# EAGLE design G848M (EAGLE 6.6.0)
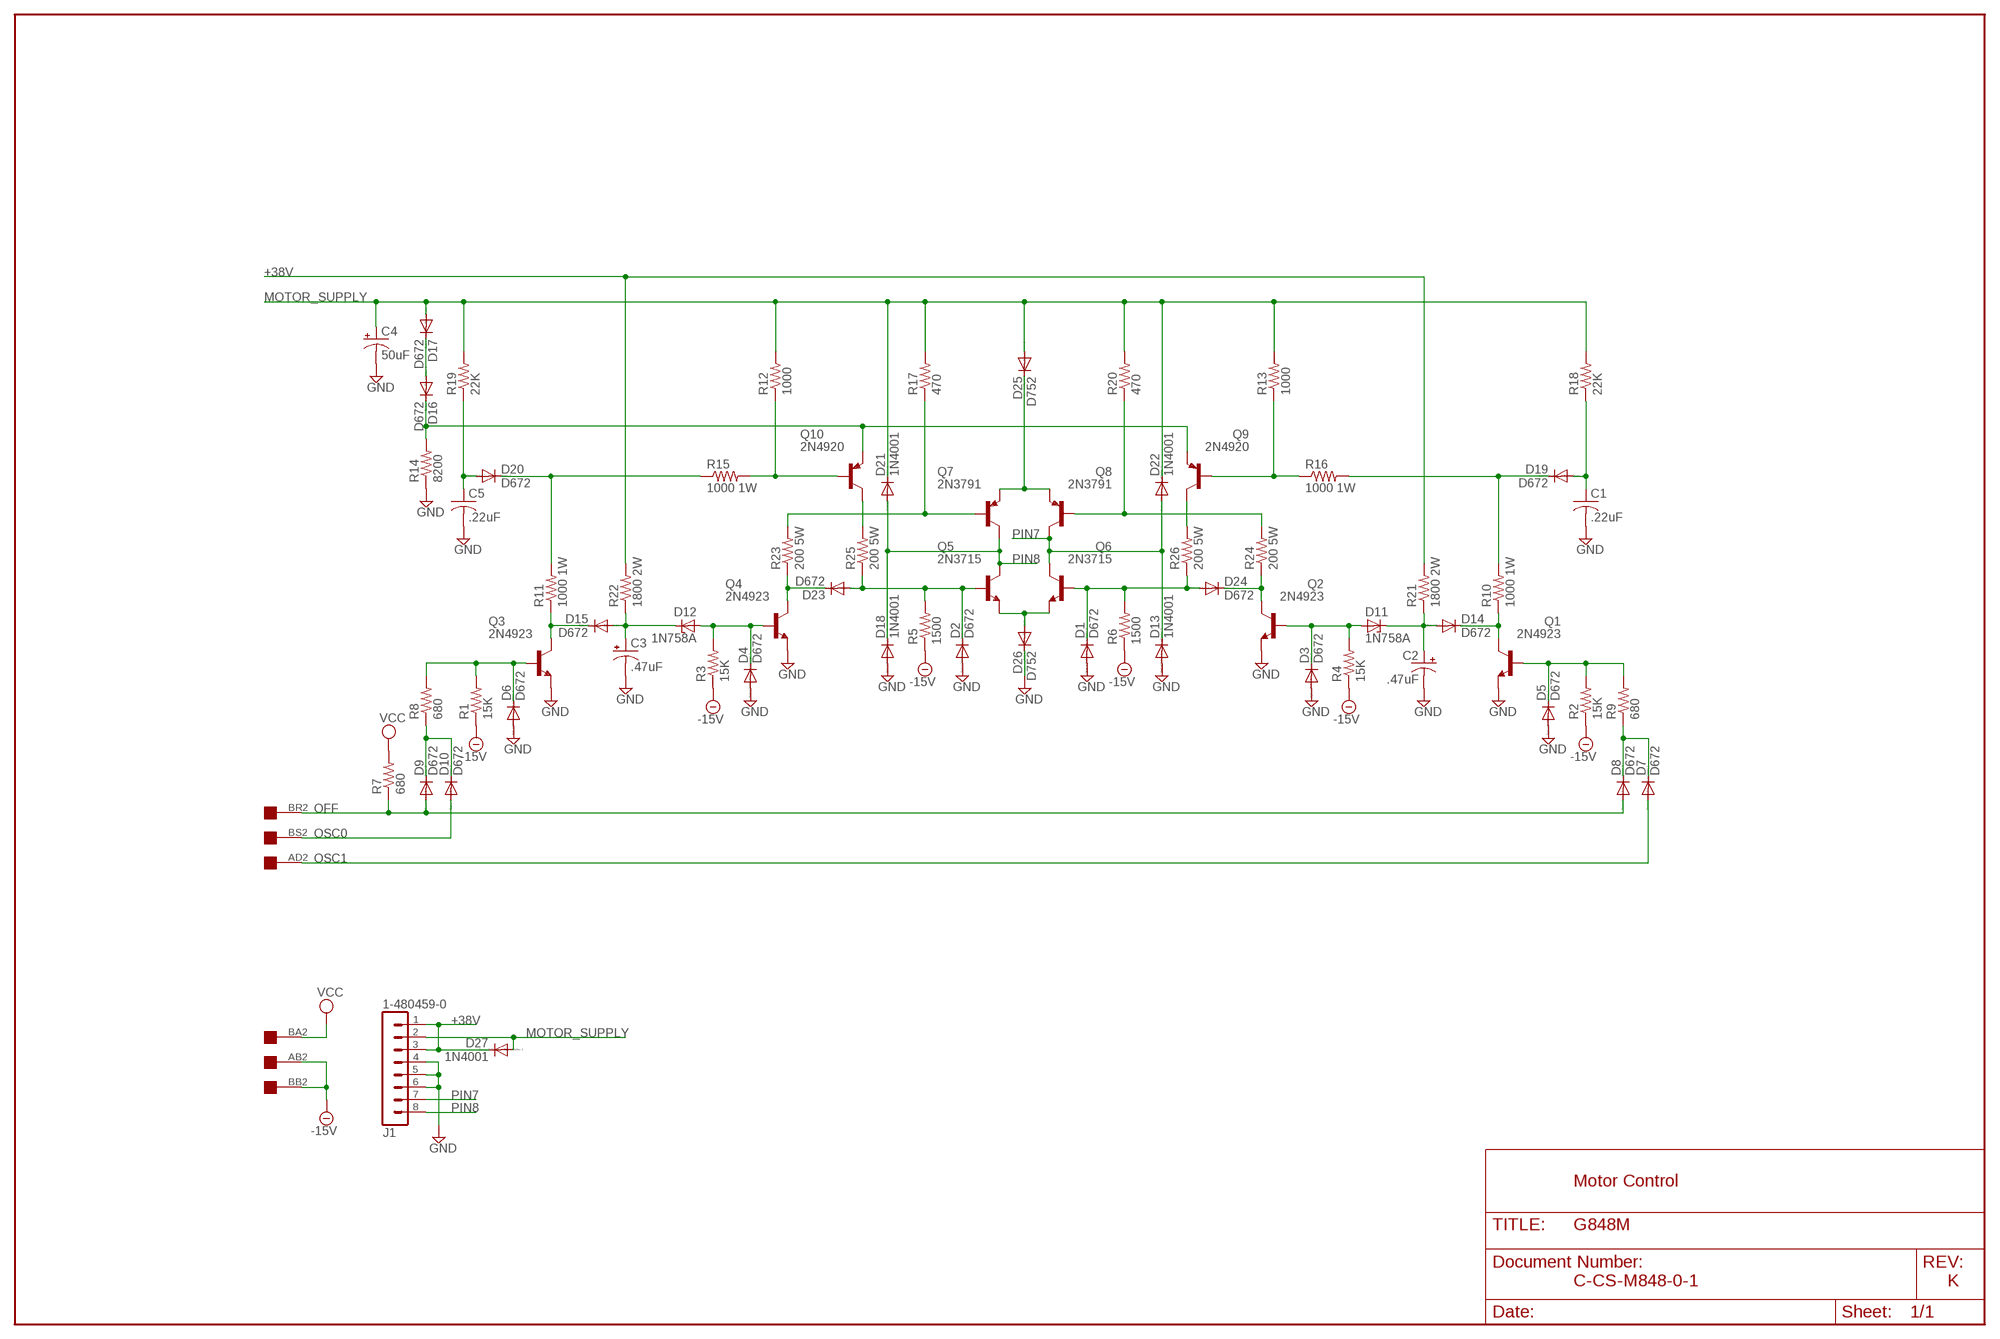
[diagram p0: schematic, sheet 1]

## Parts
C1  .22uF  C-US325-137X374  [C325-137X374]
C2  .47uF  CPOL-USE15-5AXIAL  [E15-5]
C3  .47uF  CPOL-USE15-5AXIAL  [E15-5]
C4  50uF  CPOL-USE30-10AXIAL  [E30-10]
C5  .22uF  C-US325-137X374  [C325-137X374]
D1  D672  DIODE-DO35-10  [DO35-10]
D2  D672  DIODE-DO35-10  [DO35-10]
D3  D672  DIODE-DO35-10  [DO35-10]
D4  D672  DIODE-DO35-10  [DO35-10]
D5  D672  DIODE-DO35-10  [DO35-10]
D6  D672  DIODE-DO35-10  [DO35-10]
D7  D672  DIODE-DO35-10  [DO35-10]
D8  D672  DIODE-DO35-10  [DO35-10]
D9  D672  DIODE-DO35-10  [DO35-10]
D10  D672  DIODE-DO35-10  [DO35-10]
D11  1N758A  ZENER-DIODEDO35Z10  [DO35Z10]
D12  1N758A  ZENER-DIODEDO35Z10  [DO35Z10]
D13  1N4001  1N4004  [DO41-10]
D14  D672  DIODE-DO35-10  [DO35-10]
D15  D672  DIODE-DO35-10  [DO35-10]
D16  D672  DIODE-DO35-10  [DO35-10]
D17  D672  DIODE-DO35-10  [DO35-10]
D18  1N4001  1N4004  [DO41-10]
D19  D672  DIODE-DO35-10  [DO35-10]
D20  D672  DIODE-DO35-10  [DO35-10]
D21  1N4001  1N4004  [DO41-10]
D22  1N4001  1N4004  [DO41-10]
D23  D672  DIODE-DO35-10  [DO35-10]
D24  D672  DIODE-DO35-10  [DO35-10]
D25  D752  DIODE-G4-12  [G4-12]
D26  D752  DIODE-G4-12  [G4-12]
D27  1N4001  1N4004  [DO41-10]
J1  1-480459-0  [1-480459-0]
Q1  2N4923  -NPN-TO225HH  [TO225AHH]
Q2  2N4923  -NPN-TO225HH  [TO225AHH]
Q3  2N4923  -NPN-TO225HH  [TO225AHH]
Q4  2N4923  -NPN-TO225HH  [TO225AHH]
Q5  2N3715  -NPN-TO3/  [TO3]
Q6  2N3715  -NPN-TO3/  [TO3]
Q7  2N3791  -PNP-TO3  [TO3]
Q8  2N3791  -PNP-TO3  [TO3]
Q9  2N4920  -PNP-TO225HH  [TO225AHH]
Q10  2N4920  -PNP-TO225HH  [TO225AHH]
R1  15K  R-US_0207/10  [0207/10]
R2  15K  R-US_0207/10  [0207/10]
R3  15K  R-US_0207/10  [0207/10]
R4  15K  R-US_0207/10  [0207/10]
R5  1500  R-US_0207/10  [0207/10]
R6  1500  R-US_0207/10  [0207/10]
R7  680  R-US_0207/10  [0207/10]
R8  680  R-US_0207/10  [0207/10]
R9  680  R-US_0207/10  [0207/10]
R10  1000 1W  R-US_0414/20  [0414/20]
R11  1000 1W  R-US_0414/20  [0414/20]
R12  1000  R-US_0207/10  [0207/10]
R13  1000  R-US_0207/10  [0207/10]
R14  8200  R-US_0207/10  [0207/10]
R15  1000 1W  R-US_0414/20  [0414/20]
R16  1000 1W  R-US_0414/20  [0414/20]
R17  470  R-US_0207/10  [0207/10]
R18  22K  R-US_0207/10  [0207/10]
R19  22K  R-US_0207/10  [0207/10]
R20  470  R-US_0207/10  [0207/10]
R21  1800 2W  R-US_0818/25  [0818/25]
R22  1800 2W  R-US_0818/25  [0818/25]
R23  200 5W  R-US_VTA54  [VTA54]
R24  200 5W  R-US_VTA54  [VTA54]
R25  200 5W  R-US_VTA54  [VTA54]
R26  200 5W  R-US_VTA54  [VTA54]
U$1  DOUBLE  [EDGE-CON4]

## Nets
+38V: D27.C J1.1 J1.3 R21.2 R22.2
-15V: R1.1 R2.1 R3.1 R4.1 R5.1 R6.1 U$1.AB2 U$1.BB2
GND: C1.2 C2.- C3.- C4.- C5.2 D1.A D2.A D3.A D4.A D5.A D6.A D13.A D18.A D26.C J1.4 J1.5 J1.6 Q1.1(E) Q2.1(E) Q3.1(E) Q4.1(E) R14.1
MOTOR_SUPPLY: C4.+ D17.A D21.C D22.C D25.A D27.A J1.2 R12.2 R13.2 R17.2 R18.2 R19.2 R20.2
N$1: D9.C D10.C R8.1
N$2: D16.C Q9.1(E) Q10.1(E) R14.2
N$3: D16.A D17.C
N$4: C5.1 D20.A R19.1
N$5: D15.C Q3.2(C) R11.1
N$6: C3.+ D12.C D15.A R22.1
N$7: D20.C R11.2 R15.1
N$8: D6.C Q3.3(B) R1.2 R8.2
N$9: D4.C D12.A Q4.3(B) R3.2
N$10: Q10.2(C) R25.2
N$11: D23.C Q4.2(C) R23.1
N$12: Q7.B R17.1 R23.2
N$13: D2.C D23.A Q5.B R5.2 R25.1
N$14: Q10.3(B) R12.1 R15.2
N$15: D1.C D24.A Q6.B R6.2 R26.1
N$16: D26.A Q5.E Q6.E
N$17: D25.C Q7.E Q8.E
N$18: Q8.B R20.1 R24.2
N$19: Q9.2(C) R26.2
N$20: D24.C Q2.2(C) R24.1
N$21: Q9.3(B) R13.1 R16.1
N$22: D3.C D11.A Q2.3(B) R4.2
N$23: C2.+ D11.C D14.A R21.1
N$24: D14.C Q1.2(C) R10.1
N$25: D5.C Q1.3(B) R2.2 R9.2
N$26: D7.C D8.C R9.1
N$27: D19.C R10.2 R16.2
N$28: C1.1 D19.A R18.1
OFF: D8.A D9.A R7.1 U$1.BR2
OSC0: D10.A U$1.BS2
OSC1: D7.A U$1.AD2
PIN7: D13.C D22.A J1.7 Q6.C Q6.C/(C) Q8.C Q8.C/(C)
PIN8: D18.C D21.A J1.8 Q5.C Q5.C/(C) Q7.C Q7.C/(C)
VCC: R7.2 U$1.BA2
Unconnected: U$1.AA1 U$1.AA2 U$1.AB1 U$1.AC1 U$1.AC2 U$1.AD1 U$1.AE1 U$1.AE2 U$1.AF1 U$1.AF2 U$1.AH1 U$1.AH2 U$1.AJ1 U$1.AJ2 U$1.AK1 U$1.AK2 U$1.AL1 U$1.AL2 U$1.AM1 U$1.AM2 U$1.AN1 U$1.AN2 U$1.AP1 U$1.AP2 U$1.AR1 U$1.AR2 U$1.AS1 U$1.AS2 U$1.AT1 U$1.AT2 U$1.AU1 U$1.AU2 U$1.AV1 U$1.AV2 U$1.BA1 U$1.BB1 U$1.BC1 U$1.BC2 U$1.BD1 U$1.BD2 U$1.BE1 U$1.BE2 U$1.BF1 U$1.BF2 U$1.BH1 U$1.BH2 U$1.BJ1 U$1.BJ2 U$1.BK1 U$1.BK2 U$1.BL1 U$1.BL2 U$1.BM1 U$1.BM2 U$1.BN1 U$1.BN2 U$1.BP1 U$1.BP2 U$1.BR1 U$1.BS1 U$1.BT1 U$1.BT2 U$1.BU1 U$1.BU2 U$1.BV1 U$1.BV2

## Notes on the sheet
- Motor Control
- C-CS-M848-0-1 | K

## Library data of the parts
C1 C5 = rcl:C-US: CAPACITOR, American symbol
C2-C4 = rcl:CPOL-US: POLARIZED CAPACITOR, American symbol
D1-D10 D14-D17 D19 D20 D23-D26 = diode:DIODE-: DIODE
D11 D12 = diode:ZENER-DIODE: Z-Diode
D13 D18 D21 D22 D27 = diode:1N4004: DIODE general purpose rectifier, 1 A
J1 = dec-con:1-480459-0: Mate-N-Lok 1-480459-0, board mounted.
Q1-Q6 = dec-con:*-NPN-: NPN Transistror BF959 corrected 2008.03.06
Q7-Q10 = dec-con:*-PNP-: PNP Transistror
R1-R9 R12-R14 R17-R20 R23-R26 = rcl:R-US_: RESISTOR, American symbol
R10 R11 R15 R16 = dec-con:R-US_0414/20: 0.8" Resistor
R21 R22 = dec-con:R-US_0818/25: One inch resistor
U$1 = dec-con:DOUBLE: Double-Height DEC board

## Board
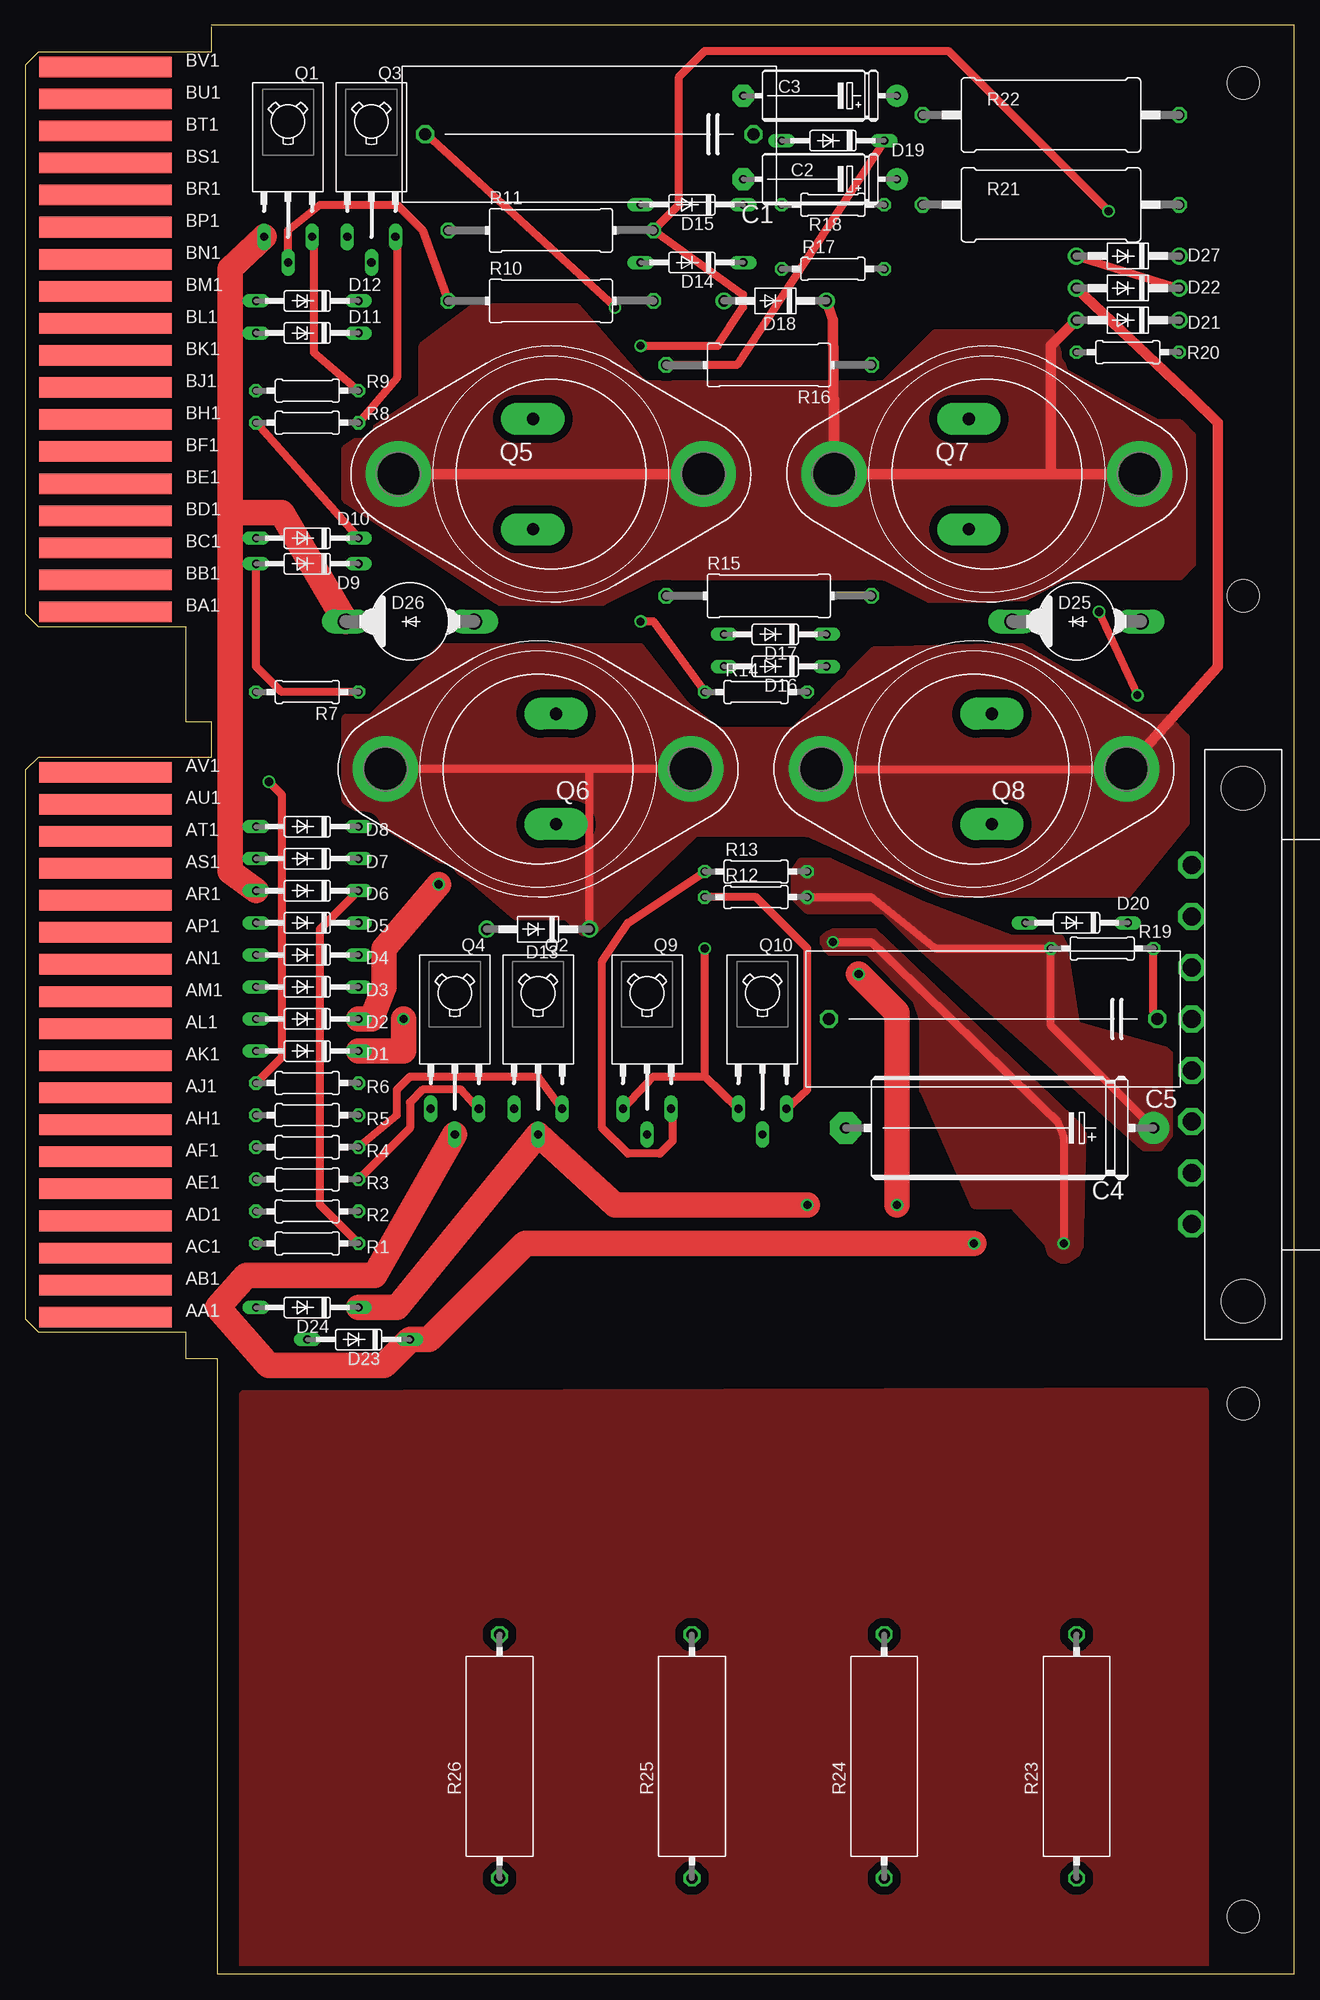
[diagram p1: board, top side]
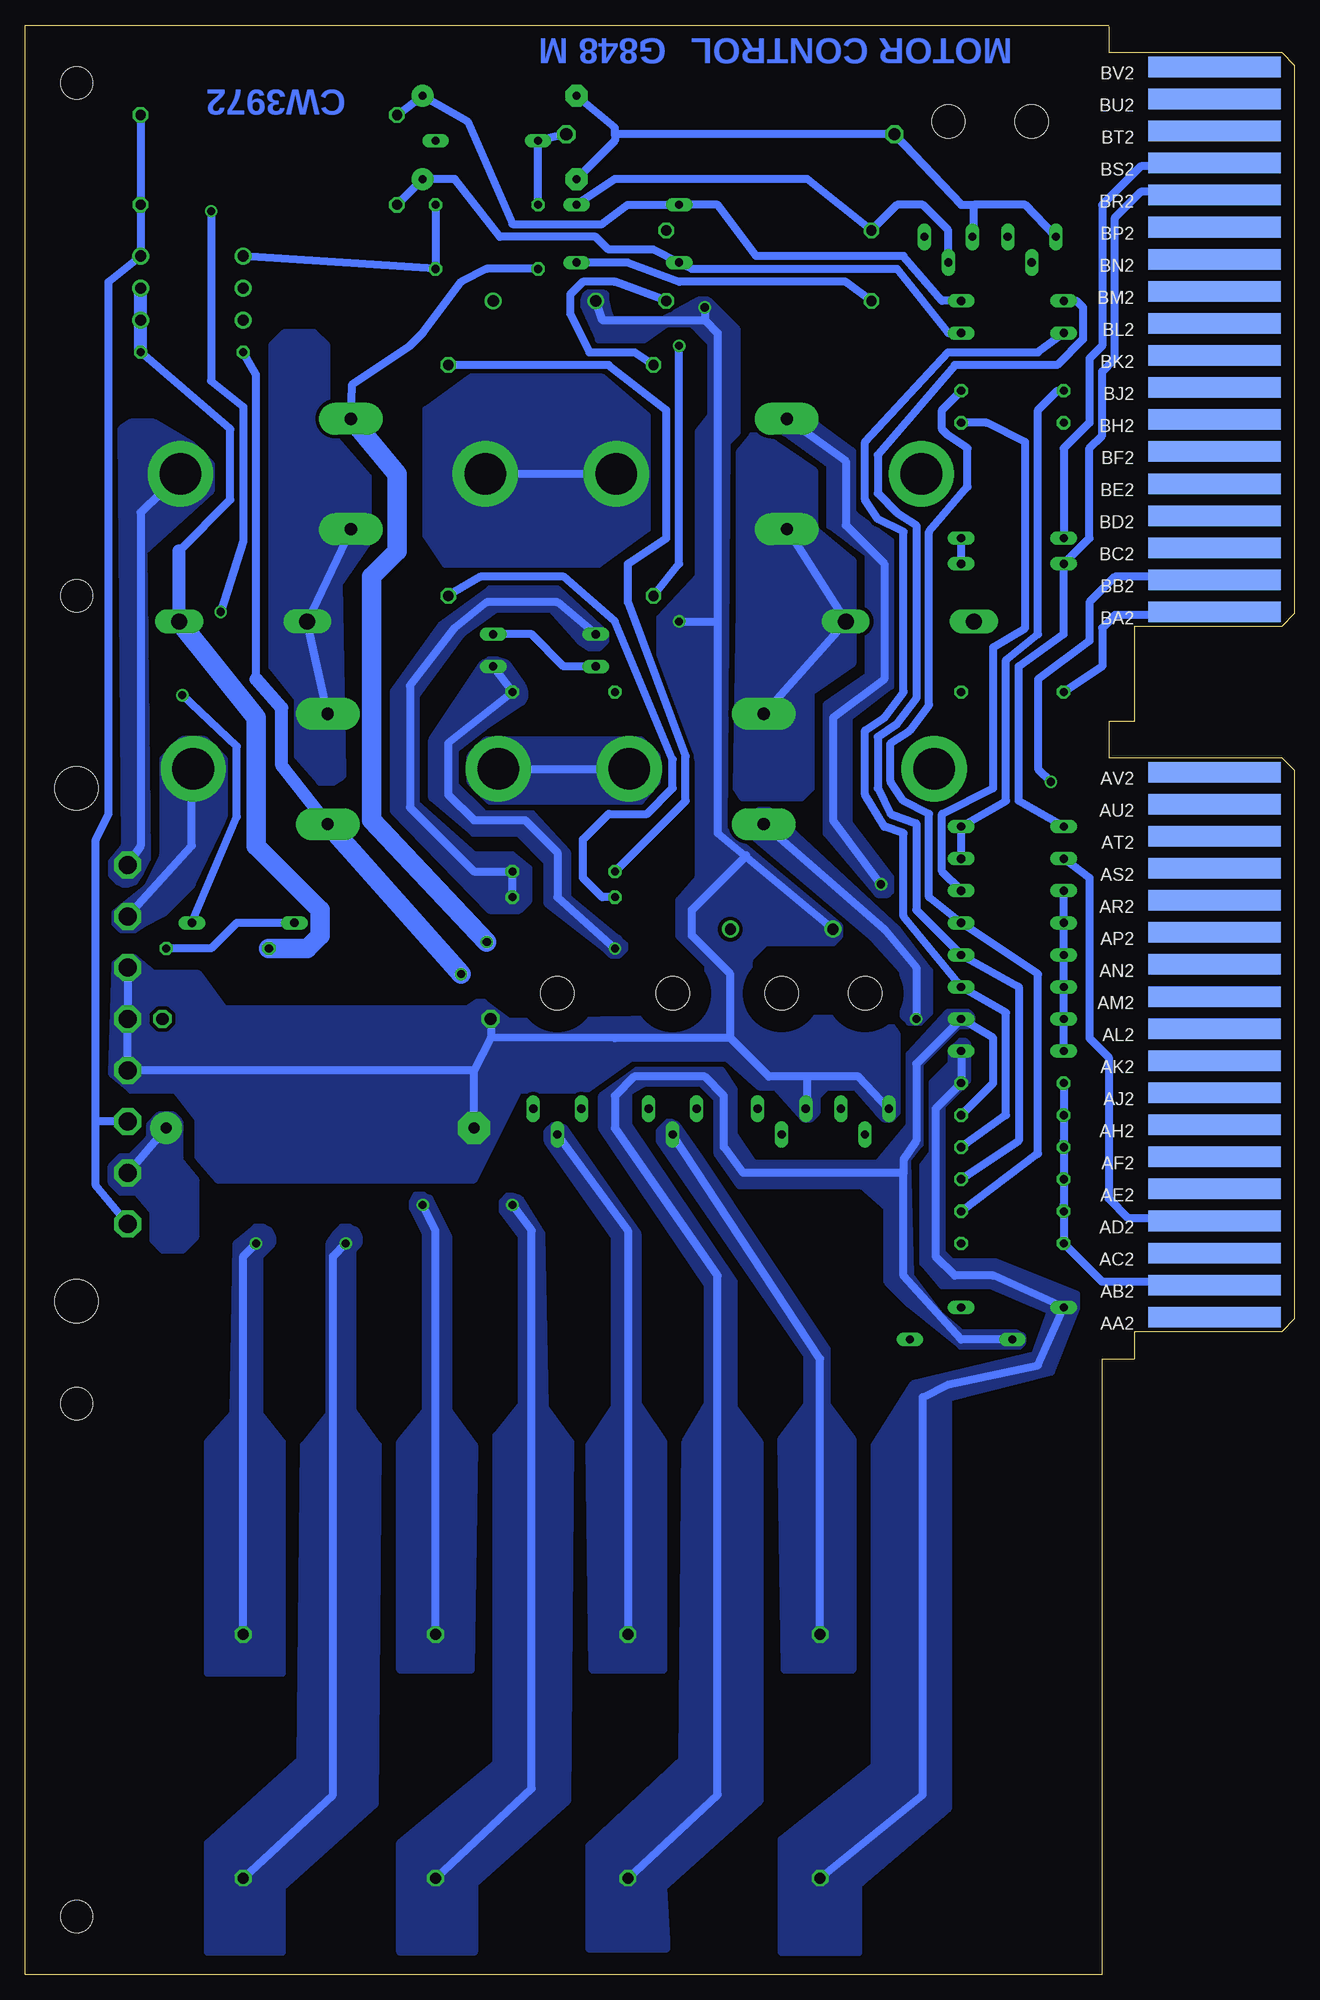
[diagram p2: board, bottom side, seen from below]

Size 125.73 x 193.04 mm. Coordinates in mm from the lower left corner, seen from the top.
Outline: 18.41,193.04 125.73,193.04 125.73,0 19.05,0 19.05,60.96 15.88,60.96
Copper layers (1+16): Top 0.035mm / dielectric 1.5mm / Bottom 0.035mm
Design rules "16mils": minimum track width 16mil, minimum drill 32mil, track to track 15mil, track to pad 10mil, pad to pad 10mil, via to via 10mil, smd to smd 10mil, copper to edge 13mil, drill to drill 10mil, minimum pad ring 10mil, minimum via ring 8mil, stop-mask expansion 0mil, vias tented up to drill 0mil, thermal gap 10mil
Holes 3.17 mm at 120.65,136.53 120.65,187.32 120.65,5.72 120.65,56.52

### Footprints (pad centres in the part's own frame; a part is rotated, then mirrored left to right if it is on the bottom)
C325-137X374 = drill 1.194 octagon: 1 -16.256,0; 2 16.256,0
E15-5 = drill 0.813 pad 2.159: + -7.62,0 | drill 0.813 pad 2.159 octagon: - 7.62,0
E30-10 = drill 1.118 pad 3.15: + -15.24,0 | drill 1.118 pad 3.15 octagon: - 15.24,0
DO35-10 = drill 0.813 long: A 5.08,0; C -5.08,0
DO35Z10 = drill 0.813 long: A 5.08,0; C -5.08,0
DO41-10 = drill 1.118: A 5.08,0; C -5.08,0
G4-12 = drill 1.6 long: A 6.35,0; C -6.35,0
1-480459-0 = drill 1.778 octagon: 1 46.99,-1.27; 2 41.91,-1.27; 3 36.83,-1.27; 4 31.75,-1.27; 5 26.67,-1.27; 6 21.59,-1.27; 7 16.51,-1.27; 8 11.43,-1.27 | hole 4.318: 3.81,3.81; 54.61,3.81
TO225AHH = drill 0.813 long: 1 -2.381,-11.43; 2 0,-13.97; 3 2.381,-11.43 | hole 3.302: 0,0
TO3 = drill 1.194 pad 3.15 long: B -1.778,5.461; E -1.778,-5.461 | drill 4.115 pad 6.477: C 15.113,0; C/ -15.113,0
0207/10 = drill 0.813 octagon: 1 -5.08,0; 2 5.08,0
0414/20 = drill 1.016 octagon: 1 -10.16,0; 2 10.16,0
0818/25 = drill 1.016 octagon: 1 -12.7,0; 2 12.7,0
VTA54 = drill 1.1 octagon: 1 -12.065,0; 2 12.065,0
EDGE-CON4 = smd 13.106 x 2.032: AA1 7.938,4.128; AB1 7.938,7.303; AC1 7.938,10.477; AD1 7.938,13.652; AE1 7.938,16.828; AF1 7.938,20.003; AH1 7.938,23.177; AJ1 7.938,26.352; AK1 7.938,29.527; AL1 7.938,32.703; AM1 7.938,35.877; AN1 7.938,39.053; AP1 7.938,42.227; AR1 7.938,45.403; AS1 7.938,48.578; AT1 7.938,51.752; AU1 7.938,54.928; AV1 7.938,58.102; BA1 7.938,73.978; BB1 7.938,77.153; BC1 7.938,80.328; BD1 7.938,83.502; BE1 7.938,86.677; BF1 7.938,89.853; BH1 7.938,93.028; BJ1 7.938,96.203; BK1 7.938,99.377; BL1 7.938,102.552; BM1 7.938,105.728; BN1 7.938,108.903; BP1 7.938,112.078; BR1 7.938,115.252; BS1 7.938,118.427; BT1 7.938,121.603; BU1 7.938,124.778; BV1 7.938,127.953 | smd 13.106 x 2.032 bottom: AA2 7.938,4.128; AB2 7.938,7.303; AC2 7.938,10.477; AD2 7.938,13.652; AE2 7.938,16.828; AF2 7.938,20.003; AH2 7.938,23.177; AJ2 7.938,26.352; AK2 7.938,29.527; AL2 7.938,32.703; AM2 7.938,35.877; AN2 7.938,39.053; AP2 7.938,42.227; AR2 7.938,45.403; AS2 7.938,48.578; AT2 7.938,51.752; AU2 7.938,54.928; AV2 7.938,58.102; BA2 7.938,73.978; BB2 7.938,77.153; BC2 7.938,80.328; BD2 7.938,83.502; BE2 7.938,86.677; BF2 7.938,89.853; BH2 7.938,93.028; BJ2 7.938,96.203; BK2 7.938,99.377; BL2 7.938,102.552; BM2 7.938,105.728; BN2 7.938,108.903; BP2 7.938,112.078; BR2 7.938,115.252; BS2 7.938,118.427; BT2 7.938,121.603; BU2 7.938,124.778; BV2 7.938,127.953

### Placement (x,y rotation side)
C1  55.88,182.25 180 top
C2  78.74,177.8 180 top
C3  78.74,186.06 180 top
C4  96.52,83.82 180 top
C5  95.89,94.62 180 top
D1  27.94,91.44 180 top
D2  27.94,94.62 180 top
D3  27.94,97.79 180 top
D4  27.94,100.97 180 top
D5  27.94,104.14 180 top
D6  27.94,107.31 180 top
D7  27.94,110.49 180 top
D8  27.94,113.66 180 top
D9  27.94,139.7 180 top
D10  27.94,142.24 180 top
D11  27.94,162.56 180 top
D12  27.94,165.74 180 top
D13  50.8,103.5 180 top
D14  66.04,169.54 180 top
D15  66.04,175.26 180 top
D16  74.3,129.54 180 top
D17  74.3,132.72 180 top
D18  74.3,165.74 180 top
D19  80.01,181.61 180 top
D20  104.14,104.14 180 top
D21  109.22,163.83 180 top
D22  109.22,167 180 top
D23  33.02,62.87 180 top
D24  27.94,66.04 180 top
D25  104.14,133.99 0 top
D26  38.1,133.99 0 top
D27  109.22,170.18 180 top
J1  116.84,121.28 270 top
Q1  26.04,183.52 0 top
Q2  50.8,97.16 0 top
Q3  34.29,183.52 0 top
Q4  42.55,97.16 0 top
Q5  52.07,148.59 0 top
Q6  50.8,119.38 180 top
Q7  95.25,148.59 0 top
Q8  93.98,119.38 180 top
Q9  61.59,97.16 0 top
Q10  73.03,97.16 0 top
R1  27.94,72.39 0 top
R2  27.94,75.56 0 top
R3  27.94,78.74 0 top
R4  27.94,81.91 0 top
R5  27.94,85.09 0 top
R6  27.94,88.27 0 top
R7  27.94,127 180 top
R8  27.94,153.67 0 top
R9  27.94,156.84 0 top
R10  52.07,165.74 0 top
R11  52.07,172.72 0 top
R12  72.39,106.68 0 top
R13  72.39,109.22 0 top
R14  72.39,127 0 top
R15  73.66,136.53 0 top
R16  73.66,159.38 180 top
R17  80.01,168.91 0 top
R18  80.01,175.26 0 top
R19  106.68,101.6 180 top
R20  109.22,160.66 0 top
R21  101.6,175.26 0 top
R22  101.6,184.15 0 top
R23  104.14,21.59 90 top
R24  85.09,21.59 90 top
R25  66.04,21.59 90 top
R26  46.99,21.59 90 top
U$1  0,60.96 0 top

### Tracks (layer width: path | path; a pad name or v marks a point on that pad's centre or on a via)
+38V
  Bottom 0.813: R22.2 R21.2 D27.C 117.47,167.64 117.47,114.94 118.75,112.4 118.75,84.45 | J1.1 118.75,78.11 118.75,84.45 | J1.3 118.75,84.45
-15V  (via drill 0.81)
  Top 0.813: v24.13,118.11 25.4,116.84 25.4,90.81 R6.1
  Bottom 0.813: U$1.BB2 8.57,138.11 8.89,138.43 17.78,138.43 20.32,135.89 20.32,132.08 25.4,128.27 25.4,119.38 v24.13,118.11 | R6.1 R5.1 22.86,82.55 R4.1 R3.1 22.86,76.2 R2.1 R1.1 19.05,68.58 8.89,68.58 8.57,68.26 U$1.AB2
GND  (via drill 0.81)
  Top 0.813: R14.1 62.23,133.99 v60.96,133.99 | v58.42,165.1 39.69,182.25 C1.2
  Top 2.54: D26.C 25.4,144.78 20.32,144.78 | 20.32,144.78 20.32,168.91 Q1.1 | D6.A 20.32,109.22 20.32,144.78
  Bottom 0.813: J1.6 J1.5 J1.4 81.28,89.53 | D6.A D5.A D4.A D3.A D2.A D1.A | C2.- 67.31,181.61 67.31,182.25 | 67.31,182.25 67.31,182.88 C3.- | 67.31,182.25 C1.2 33.02,175.26 31.75,175.26 | C4.- 81.28,89.53 | C5.2 79.59,92.78 | 79.59,92.78 81.28,89.53 | Q4.1 43.18,88.9 48.26,88.9 | 48.26,88.9 52.07,88.9 55.88,92.71 | 55.88,92.71 67.31,92.71 79.59,92.78 | Q2.1 48.26,86.36 48.26,88.9 | Q1.1 26.67,175.26 31.75,175.26 | Q3.1 31.75,172.72 31.75,175.26 | D18.A 68.58,163.83 58.42,163.83 | 58.42,163.83 57.15,162.56 57.15,133.99 | 57.15,133.99 57.15,113.03 D13.A | v60.96,133.99 57.15,133.99 | 55.88,92.71 55.88,99.06 59.69,102.87 59.69,105.41 54.29,110.81 | v58.42,165.1 58.42,163.83
  pour Bottom (no thermals): 81.28,78.74 76.83,87.63 70.17,87.63 65.72,90.81 56.2,90.81 53.02,87.95 51.44,87.95 48.58,84.77 47.94,84.77 47.31,85.41 47.31,87 46.35,87.95 43.5,87.95 41.27,85.41 40.64,84.77 40.01,84.77 39.37,85.41 39.37,93.03 40.01,93.98 40.96,94.62 52.7,94.62 54.29,96.52 53.98,100.65 52.39,102.23 45.72,102.23 45.09,102.87 45.09,103.82 56.52,113.35 56.2,151.77 55.24,152.72 55.24,162.88 58.1,165.74 59.05,165.74 62.55,163.83 67.63,163.83 67.94,164.47 68.26,165.74 68.26,166.37 68.9,166.69 69.53,166.69 70.17,166.37 70.48,165.42 68.9,161.93 64.45,161.93 62.23,163.51 59.69,163.51 57.78,161.61 57.78,154.31 59.05,152.72 59.05,138.43 62.87,134.3 62.87,130.81 59.05,120.33 59.05,108.59 60.96,106.36 60.96,102.87 58.1,100.01 58.1,96.2 59.69,94.62 77.79,94.3 80.33,96.2 80.96,96.2 81.92,95.57 106.05,95.57 108.58,99.06 113.03,99.06 114.94,100.65 115.89,100.65 116.84,100.01 117.16,89.22 115.25,87.63 110.81,87.63 108.58,84.77 108.58,80.96 106.68,78.74
MOTOR_SUPPLY
  Top 0.813: D27.A D22.C | R12.2 83.82,106.68 90.17,101.6 R19.2 101.6,93.98 C4.+
  Bottom 0.813: C4.+ J1.2 | D17.A 73.03,135.89 80.01,135.89 83.19,133.35 87.63,127.63 87.63,115.57 81.28,109.22 R13.2 R12.2 | 110.49,140.97 105.41,146.05 105.41,153.03 R20.2 | D27.A R17.2 R18.2
  Bottom 1.27: D25.A 110.49,140.97 | R20.2 D21.C D22.C
  Bottom 1.93: R19.2 97.79,101.6 96.52,102.87 96.52,105.41 102.87,111.76 102.87,124.46 D25.A
  pour Bottom (no thermals): 108.9,73.03 110.17,71.75 112.08,71.75 113.03,72.71 113.03,75.56 114.62,77.47 116.2,77.47 117.16,78.42 117.16,79.69 117.16,80.01 116.2,80.96 115.25,80.96 113.67,82.55 113.35,82.87 113.35,84.14 112.39,85.09 111.12,85.09 110.49,84.45 110.49,80.64 108.9,78.74
  pour Bottom (no thermals): 76.83,105.41 75.88,106.36 75.88,109.54 77.47,110.81 81.28,110.81 87,115.89 87,122.87 87,126.68 82.55,132.72 79.06,135.25 73.66,135.25 70.8,132.08 69.85,131.44 68.9,131.44 68.26,132.08 68.26,132.72 68.9,133.35 73.03,137.16 79.69,137.16 84.45,133.67 89.22,127 89.22,115.25 79.69,105.41
  pour Top (no thermals): 76.2,109.22 76.2,106.68 77.47,105.41 85.09,105.41 88.9,101.6 110.81,81.91 112.39,81.91 113.35,83.19 113.35,91.12 113.03,91.44 104.14,93.98 102.87,101.92 102.55,102.55 97.79,102.55 88.58,106.05 79.69,110.17 76.83,110.17
N$1
  Top 0.813: R8.1 D10.C
  Bottom 0.813: D9.C D10.C
N$2  (via drill 0.81)
  Top 0.813: Q9.1 62.23,88.9 67.31,88.9 | 67.31,88.9 v67.31,101.6 | Q10.1 67.31,88.9
  Bottom 0.813: D16.C R14.2 83.82,121.92 83.82,116.84 81.28,114.3 76.2,114.3 73.03,111.12 73.03,106.68 v67.31,101.6
  pour Bottom (no thermals): 68.26,101.6 73.98,106.05 73.98,110.17 76.83,113.03 81.28,113.03 85.41,116.52 85.41,122.24 80.33,129.86 79.69,130.18 79.06,130.18 78.11,129.86 76.52,127.63 76.2,126.68 76.52,126.05 80.33,123.51 83.19,121.28 83.19,117.79 80.64,115.25 80.33,114.94 75.88,114.94 75.56,114.94 72.07,111.12 72.07,106.68 66.99,102.55 66.36,101.92 66.36,101.6 66.99,100.97 67.63,100.97
N$3
  Bottom 0.813: D16.A 72.39,129.54 75.56,132.72 D17.C
N$4
  Top 0.813: C5.1 111.76,95.25 R19.1
  Bottom 0.813: D20.A 104.78,104.14 107.31,101.6 R19.1
N$5
  Bottom 0.813: Q3.2 34.29,172.72 36.83,175.26 39.37,175.26 R11.1 48.26,177.8 67.31,177.8 D15.C
N$6
  Bottom 0.813: R22.1 C3.+ 81.92,183.52 77.47,173.35 68.58,173.35 66.04,175.26 D15.A 57.15,175.26 53.34,170.18 38.73,170.18 34.92,165.74 D12.C
N$7  (via drill 0.81)
  Top 0.813: v60.96,161.29 68.58,161.29 71.12,165.1 71.12,166.37 R11.2 64.77,175.26 64.77,187.96 67.31,190.5 91.44,190.5 v107.31,174.62 | v106.36,134.94 v110.17,126.68
  Bottom 0.813: R15.1 60.96,139.7 v60.96,161.29 | D20.C 104.78,114.62 104.78,121.6 v110.17,126.68 | v107.31,174.62 107.31,157.8 104.14,155.26 104.14,141.92 v106.36,134.94
N$8
  Top 0.813: R1.2 29.21,76.2 29.21,103.5 D6.C | Q3.3 36.83,171.77 36.83,158.12 R8.2
  Bottom 0.813: D6.C 34.92,109.22 34.92,114.94 29.84,117.47 29.84,131.44 26.67,133.35 26.67,151.77 30.48,153.67 R8.2
N$9
  Top 0.813: Q4.3 43.18,87.63 39.37,87.63 38.1,86.36 38.1,83.82 R3.2
  Bottom 0.813: D12.A 21.59,165.74 20.95,165.1 20.95,161.93 23.5,159.38 33.66,159.38 41.27,150.5 41.27,146.69 39.37,144.78 37.47,143.51 37.47,126.37 39.37,123.83 41.27,122.56 41.27,117.47 40.01,114.94 37.47,113.98 37.47,105.41 D4.C 27.3,97.79 27.3,82.55 R3.2
N$10
  Bottom 0.813: Q10.2 66.04,73.66 R25.2
  pour Bottom (no thermals): 62.55,30.16 69.53,30.16 69.85,52.39 67.31,56.2 67.31,73.03 73.98,82.55 73.98,83.5 73.34,84.14 72.39,83.82 69.53,79.69 65.09,73.34 65.09,62.23 65.09,56.52 62.55,52.7
N$11  (via drill 0.81)
  Top 2.54: Q4.2 34.61,69.22 21.91,69.22 19.05,66.04 24.13,60.33 35.56,60.33 D23.C 40.01,62.87 49.53,72.39 v93.98,72.39
  Bottom 0.813: R23.1 95.25,17.78 95.25,71.12 v93.98,72.39
  pour Bottom (no thermals): 100.33,2.22 107.63,2.22 107.63,13.02 98.42,21.27 98.11,52.39 95.57,55.56 95.57,72.07 95.57,72.39 94.93,73.34 94.3,73.98 93.66,73.98 93.03,73.66 92.71,73.03 92.71,72.39 93.34,71.75 93.34,61.91 93.34,55.88 90.81,52.39 91.12,16.83 100.33,8.57
N$12  (via drill 0.81)
  Top 0.813: v80.01,102.23 83.82,102.23 102.23,84.45 102.87,82.87 v102.87,72.39
  Bottom 0.813: R23.2 104.14,71.12 v102.87,72.39 | R17.1 80.01,168.91 82.55,167.64 86.36,162.56 87.63,161.29 93.34,157.48 Q7.B
  Bottom 1.93: Q7.B 88.9,148.59 88.9,140.97 91.44,138.43 91.44,114.3 v80.01,102.23
  pour Bottom (no thermals): 100.33,29.85 107.63,29.85 107.63,52.7 105.09,55.56 104.78,72.39 102.87,73.98 102.23,73.98 101.6,73.66 101.28,73.03 101.28,72.39 102.55,71.12 102.55,55.56 100.33,52.7
  pour Top (no thermals): 88.27,96.52 88.9,94.62 88.9,87.63 93.98,76.2 97.79,76.2 101.28,72.39 101.6,71.44 102.55,70.8 103.19,70.8 104.14,71.44 104.46,72.07 104.78,83.19 104.46,83.82 84.14,103.19 80.01,103.19 79.38,102.87 79.06,102.55 79.06,102.23 79.38,101.6 79.69,101.28 83.5,101.28
N$13  (via drill 0.81)
  Top 2.54: D2.C 34.29,94.62 35.56,97.79 35.56,101.6 v40.96,107.95
  Bottom 0.813: R5.2 29.84,88.27 29.84,92.71 D2.C 37.47,90.17 37.47,82.55 38.73,80.64 38.73,79.38 | D23.A 33.02,62.87 38.73,69.22 38.73,79.38 | R25.1 57.15,17.78 57.15,69.22 67.31,83.82 67.31,87 65.41,88.9 58.42,88.9 56.52,87 56.52,81.91 54.61,79.38 38.73,79.38 | Q5.B 44.45,149.86 44.45,143.51 40.64,139.7 40.64,128.27 45.72,124.46 45.72,114.3 v40.96,107.95
  pour Bottom (no thermals): 62.23,2.54 69.85,2.54 69.85,12.7 60.64,21.27 60.33,52.7 58.1,56.52 58.1,68.26 68.58,83.82 68.58,87 65.09,89.53 56.83,89.53 55.56,87.63 55.56,83.19 53.66,80.33 41.27,80.33 38.1,84.14 38.1,91.12 34.29,95.25 32.38,95.25 32.07,94.93 32.07,94.3 32.38,93.98 33.34,93.98 37.15,90.17 37.15,82.23 38.42,80.64 38.1,69.22 35.24,65.41 33.02,63.5 27.62,63.5 26.99,63.18 26.99,62.55 27.3,62.23 33.02,62.23 38.1,66.36 40.32,68.58 40.32,75.88 42.86,78.11 54.93,78.11 57.15,81.28 57.15,86.68 58.74,88.27 64.45,88.27 66.04,87.31 66.04,84.14 55.56,68.58 55.56,56.2 53.02,52.7 53.02,17.15 62.55,8.57
  pour Bottom (no thermals): 46.35,113.03 41.27,107 40.32,107 40.01,107.31 40.01,108.59 44.13,113.98 44.13,124.46 40.01,127.63 40.01,141.92 43.5,144.46 43.81,144.78 43.81,150.81 49.85,155.26 50.8,155.26 51.44,154.62 51.44,153.67 50.48,152.72 46.04,149.54 46.04,143.51 42.23,140.65 42.23,128.59 46.35,125.73
N$14
  Top 0.813: Q10.3 77.47,87.63 77.47,101.6 72.39,106.68 R12.1
  Bottom 0.813: R12.1 68.58,106.68 70.48,108.59 70.48,112.4 67.94,114.94 64.14,114.94 61.59,117.47 61.59,120.33 67.31,133.99 72.39,138.43 80.64,138.43 R15.2
N$15  (via drill 0.81)
  Top 2.54: D1.C 37.47,91.44 v37.47,94.62
  Bottom 0.813: R26.1 36.83,17.78 36.83,57.15 34.29,58.42 25.4,60.33 D24.A 29.84,69.22 33.66,69.22 35.56,71.12 35.56,85.72 R6.2 D1.C | Q6.B 40.64,103.5 37.47,99.69 v37.47,94.62
  pour Bottom (no thermals): 43.18,2.22 43.18,8.89 34.29,16.51 34.29,57.15 24.13,59.69 21.59,66.04 21.59,67.31 29.53,70.48 33.97,70.48 34.92,71.44 34.92,86.04 32.38,88.58 32.38,92.08 32.7,92.39 33.02,92.39 33.97,91.44 33.97,90.17 35.88,88.27 35.88,81.28 36.83,80.01 36.83,70.48 34.92,68.26 30.16,68.26 24.13,65.72 25.72,61.28 37.78,58.42 41.59,52.39 41.59,20.64 50.8,13.34 50.8,2.22
  pour Bottom (no thermals): 36.2,99.38 36.2,95.25 37.15,94.3 38.1,94.3 38.73,94.93 38.73,99.38 41.59,102.55 53.98,113.03 53.98,114.3 53.02,115.25 52.07,115.25 39.37,103.5
N$16
  Bottom 0.813: Q6.E D26.A Q5.E
  pour Bottom (no thermals): 43.81,129.86 47.94,127 47.94,117.47 48.9,116.52 54.61,116.52 55.24,117.47 54.93,135.25 54.93,150.81 53.66,152.4 52.7,152.4 47.62,148.91 47.62,143.19 43.81,140.02
N$17
  Bottom 0.813: Q8.E D25.C Q7.E
  pour Bottom (no thermals): 94.3,119.06 94.61,137.79 91.76,141.92 91.76,148.27 95.89,153.03 95.89,156.53 95.89,161.29 97.16,162.56 100.01,162.56 101.28,161.29 101.28,145.1 101.28,129.54 98.74,126.37 98.74,120.65 96.52,118.11 95.25,118.11 94.3,118.75
N$18  (via drill 0.81)
  Top 2.54: v82.55,99.06 86.36,95.25 v86.36,76.2
  Bottom 0.813: R24.2 85.09,73.66 v86.36,76.2 | 102.87,128.27 102.87,158.43 R20.1
  Bottom 1.27: Q8.B 100.33,119.7 100.33,125.41 102.87,128.27
  Bottom 1.93: Q8.B v82.55,99.06
  pour Bottom (no thermals): 81.6,30.16 88.58,30.16 88.58,52.7 86.04,55.88 86.04,73.34 87.31,75.88 87.31,76.52 87,77.15 86.36,77.15 85.72,76.84 83.82,73.03 83.82,55.88 81.28,52.39
N$19
  Bottom 0.813: R26.2 46.99,60.96 Q9.2
  pour Bottom (no thermals): 43.81,30.16 50.48,30.16 50.8,53.02 48.26,56.52 48.26,61.28 62.87,82.55 62.87,83.5 61.91,84.45 61.28,84.14 59.05,80.96 46.35,61.91 46.35,56.52 43.81,53.02
N$20  (via drill 0.81)
  Top 2.54: D24.C 36.83,66.04 Q2.2 58.42,76.2 v77.47,76.2
  Bottom 0.813: R24.1 75.56,18.41 75.56,73.66 v77.47,76.2
  pour Bottom (no thermals): 81.6,2.22 88.58,2.22 88.58,13.02 79.06,20.95 79.06,30.16 79.06,53.34 76.52,56.52 76.52,73.03 78.42,75.56 78.42,76.2 78.42,76.52 77.79,77.15 76.83,76.84 74.61,73.34 74.3,56.2 71.75,52.7 72.07,17.15 81.28,8.89 81.28,2.22
N$21
  Top 0.813: Q9.3 64.14,85.09 64.14,82.55 62.87,81.28 59.69,81.28 57.15,83.82 57.15,100.33 59.69,104.14 R13.1
  Bottom 0.813: R13.1 60.33,116.2 60.33,120.65 66.04,135.89 66.04,139.7 62.23,142.24 62.23,154.94 67.94,159.38 R16.1
N$22
  Top 0.813: R4.2 36.83,85.09 36.83,87.63 38.1,88.9 50.8,88.9 Q2.3
  Bottom 0.813: R4.2 28.57,85.09 28.57,95.25 D3.C 38.73,104.78 38.73,113.03 40.64,113.66 42.55,116.84 42.55,123.19 40.64,124.46 38.73,127 38.73,142.88 41.27,144.15 42.55,146.05 42.55,151.77 34.29,160.66 25.4,160.66 D11.A
N$23
  Bottom 0.813: R21.1 C2.+ 83.19,177.8 78.74,172.09 69.22,172.09 67.94,170.81 63.5,170.81 D14.A 59.69,168.91 39.37,168.91 34.29,162.56 D11.C
N$24
  Top 0.813: Q1.2 26.04,172.72 29.21,175.26 36.83,175.26 39.37,172.72 R10.1
  Bottom 0.813: R10.1 44.45,167.64 60.96,167.64 66.04,169.54 D14.C
N$25
  Top 0.813: Q1.3 28.57,171.77 28.57,160.66 R9.2
  Bottom 0.813: R2.2 25.4,81.28 25.4,99.06 D5.C 36.2,106.68 36.2,114.94 38.73,116.2 40.01,118.11 40.01,121.92 38.1,123.19 36.2,125.73 36.2,142.88 32.38,147.32 32.38,151.13 34.29,152.4 34.92,153.03 34.92,154.94 R9.2
N$26
  Bottom 0.813: D7.C D8.C 28.57,116.2 28.57,130.18 25.4,132.72 25.4,154.94 23.5,156.84 R9.1
N$27
  Top 0.813: D19.C 70.48,159.38 R16.2
  Bottom 0.813: R16.2 65.41,160.66 69.85,160.66 71.75,164.47 71.75,166.37 70.48,167.64 67.31,167.64 R10.2
N$28
  Bottom 0.813: C1.1 D19.A R18.1
N$29
  pour Top (isolate 0.813): 21.59,0 21.59,57.47 116.84,57.79 116.84,0
OFF
  Top 0.813: R7.1 25.4,127 22.86,129.54 D9.A
  Bottom 0.813: U$1.BR2 8.57,176.21 8.89,176.53 15.24,176.53 17.78,173.99 17.78,160.02 19.05,158.75 19.05,152.4 20.32,151.13 20.32,142.24 D9.A 22.86,132.72 27.3,129.54 27.3,116.2 D8.A
OSC0
  Bottom 0.813: U$1.BS2 8.89,179.39 8.89,179.07 15.24,179.07 19.05,175.26 19.05,161.29 20.32,160.02 20.32,153.67 22.86,151.13 D10.A
OSC1
  Bottom 0.813: D7.A 20.32,108.59 20.32,92.71 18.41,90.81 18.41,76.84 16.51,74.93 8.89,74.93 U$1.AD2
PIN7
  Top 0.813: Q8.C Q8.C/ | Q6.C/ 55.88,119.38 | 55.88,119.38 Q6.C | D13.C 55.88,119.38
  Top 1.016: D22.A 115.57,156.21 118.11,153.67 118.11,129.54 Q8.C/
  Bottom 0.813: Q8.C Q6.C/ | J1.7 109.22,111.76 109.22,119.38 Q8.C/
  pour Bottom (no thermals): 64.77,116.2 79.69,116.2 81.6,118.11 81.6,120.65 80.01,122.24 64.77,122.24 63.18,120.65 63.18,118.11
  pour Bottom (no thermals): 109.22,107.95 106.05,114.62 106.05,120.33 107.95,122.24 110.17,122.24 112.08,120.33 112.08,110.81 113.67,107.63 116.84,105.09 116.84,104.14 116.2,103.5 114.94,103.5 113.98,104.14 112.08,105.09
  pour Top (isolate 0.813, no thermals): 31.75,116.2 31.75,124.46 34.29,124.46 41.27,131.44 60.96,131.44 65.41,125.73 68.58,123.19 76.2,123.19 84.14,131.13 95.89,131.44 98.74,131.44 110.49,124.46 113.03,124.46 114.94,122.56 114.94,113.98 109.22,107 90.81,107 77.47,113.03 66.36,113.03 56.2,103.19 55.24,103.19 53.66,104.78 48.58,104.78 44.13,108.59
PIN8
  Top 1.016: Q5.C/ Q5.C | 101.6,148.59 Q7.C/ 80.01,163.83 D18.C | 101.6,148.59 Q7.C | D21.A 101.6,161.29 101.6,148.59
  Bottom 0.813: Q5.C Q7.C/ | Q7.C 114.3,144.78 114.3,111.76 J1.8
  pour Bottom (no thermals): 113.67,110.81 113.98,140.97 107.31,147 107.31,149.54 109.22,151.45 113.03,153.67 115.25,153.67 116.2,153.03 115.89,111.76 117.16,110.17 117.16,108.9 116.52,108.27 115.89,107.95 114.94,108.27 114.3,109.22 113.67,110.49
  pour Bottom (no thermals): 64.14,147.32 64.14,154.31 68.58,158.12 81.6,158.12 86.04,154.94 86.04,142.56 84.14,139.7 68.9,139.7 64.14,143.19
  pour Top (isolate 0.813, no thermals): 31.75,146.05 31.75,151.13 39.37,156.21 39.37,161.29 44.45,165.1 54.61,165.1 60.64,158.12 61.28,157.48 85.09,157.48 90.17,162.56 101.6,162.56 102.87,158.75 112.08,153.67 114.3,153.67 115.57,152.4 115.57,139.7 114.3,138.43 102.87,138.43 98.74,136.21 89.53,136.21 85.09,138.43 62.23,138.43 57.15,135.89 46.99,135.89
VCC
  Bottom 0.813: U$1.BA2 8.57,134.94 8.89,134.62 17.78,134.62 19.05,133.35 19.05,129.54 R7.2

### Text on the board
Bottom: MOTOR CONTROL | G848 M | CW3972